# EAGLE design Messchieber (EAGLE 6.4)

## Sheet 1 of 4
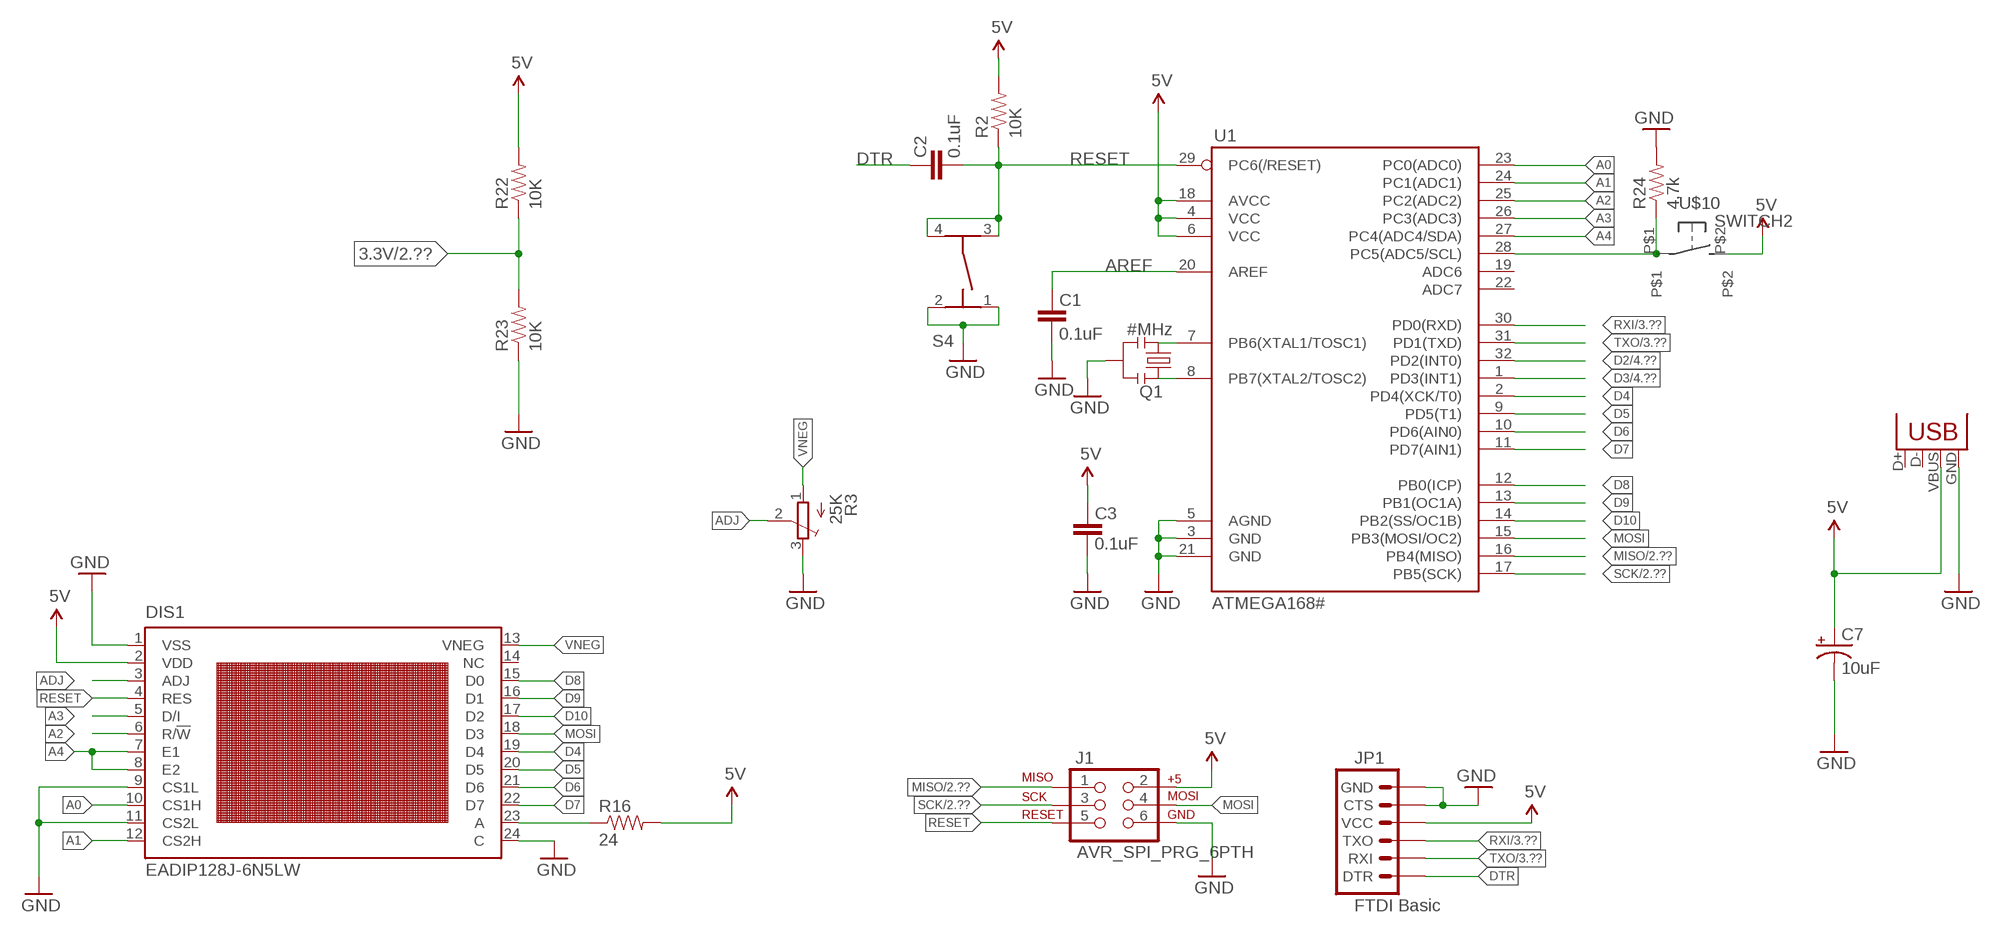
[diagram p0: schematic, sheet 1]

### Parts
C1  0.1uF  CAP0805  [0805]
C2  0.1uF  CAP0805  [0805]
C3  0.1uF  CAP0805  [0805]
C7  10uF  10UF-16V-10%(TANT)  [EIA3216]
DIS1  EADIP128J-6N5LW  [LCD-DIP128-64]
J1  AVR_SPI_PRG_6PTH  [2X3]
JP1  FTDI Basic  ARDUINO_SERIAL_PROGRAMPTH  [1X06]
JP7  USB-SMD-NS  [USB-MINIB-NOSTOP]
Q1  #MHz  RESONATORSMD  [RESONATOR-SMD]
R2  10K  RESISTOR  [0805]
R3  25K  TRIM_EU-SM-42/43A  [SM-42/43A]
R16  24  RESISTOR  [0805]
R22  10K  RESISTOR  [0805]
R23  10K  RESISTOR  [0805]
R24  4,7k  RESISTOR  [0805]
S4  TASTER-9314_SMD  [TASTER-9314_SMD]
U1  ATMEGA168#  ATMEGA168  [TQFP32-08]
U$10  SWITCH2  [SWITCH2]

### Nets
3.3V: R22.1 R23.2 ; also sheet 2,3,4
5V: C3.2 C7.A(+) DIS1.2(VDD) J1.2 JP1.4(VCC) JP7.VBUS R2.2 R16.2 R22.2 U1.4(VCC) U1.6(VCC) U1.18(AVCC) U$10.P$2 ; also sheet 2,3,4
A0: DIS1.10(CS1H) U1.23(PC0(ADC0))
A1: DIS1.12(CS2H) U1.24(PC1(ADC1))
A2: DIS1.6(R/!W) U1.25(PC2(ADC2))
A3: DIS1.5(D/I) U1.26(PC3(ADC3))
A4: DIS1.7(E1) DIS1.8(E2) U1.27(PC4(ADC4/SDA))
ADJ: DIS1.3(ADJ) R3.2(S)
AREF: C1.2 U1.20(AREF)
D2: U1.32(PD2(INT0)) ; also sheet 4
D3: U1.1(PD3(INT1)) ; also sheet 4
D4: DIS1.19(D4) U1.2(PD4(XCK/T0))
D5: DIS1.20(D5) U1.9(PD5(T1))
D6: DIS1.21(D6) U1.10(PD6(AIN0))
D7: DIS1.22(D7) U1.11(PD7(AIN1))
D8: DIS1.15(D0) U1.12(PB0(ICP))
D9: DIS1.16(D1) U1.13(PB1(OC1A))
D10: DIS1.17(D2) U1.14(PB2(SS/OC1B))
DTR: C2.2 JP1.1(DTR)
GND [vcc]: C1.1 C3.1 C7.C(-) DIS1.1(VSS) DIS1.9(CS1L) DIS1.11(CS2L) DIS1.24(C) J1.6 JP1.5(CTS) JP1.6(GND) JP7.GND Q1.2 R3.3(E) R23.1 R24.2 S4.1 S4.2 U1.3(GND) U1.5(AGND) U1.21(GND) ; also sheet 2,3,4
MISO: J1.1 U1.16(PB4(MISO)) ; also sheet 2
MOSI: DIS1.18(D3) J1.4 U1.15(PB3(MOSI/OC2))
N$1: Q1.1 U1.8(PB7(XTAL2/TOSC2))
N$2: Q1.3 U1.7(PB6(XTAL1/TOSC1))
N$6: R24.1 U1.28(PC5(ADC5/SCL)) U$10.P$1
N$29: DIS1.23(A) R16.1
RESET: C2.1 DIS1.4(RES) J1.5 R2.1 S4.3 S4.4 U1.29(PC6(/RESET))
RXI: JP1.3(TXO) U1.30(PD0(RXD)) ; also sheet 3
SCK: J1.3 U1.17(PB5(SCK)) ; also sheet 2
TXO: JP1.2(RXI) U1.31(PD1(TXD)) ; also sheet 3
VNEG: DIS1.13(VNEG) R3.1(A)
Unconnected: DIS1.14(NC) JP7.D+ JP7.D- U1.19(ADC6) U1.22(ADC7)

## Sheet 2 of 4
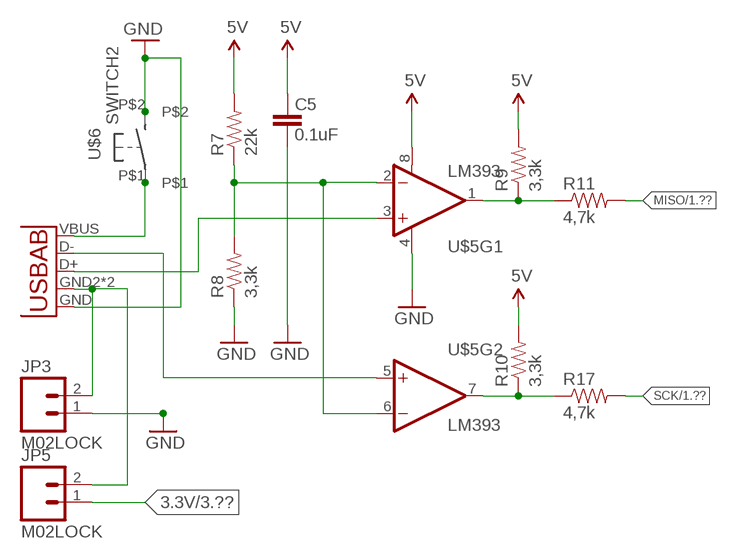
[diagram p1: schematic, sheet 2]

### Parts
C5  0.1uF  CAP0805  [0805]
JP3  M02LOCK  [1X02_LOCK]
JP5  M02LOCK  [1X02_LOCK]
R7  22k  RESISTOR  [0805]
R8  3,3k  RESISTOR  [0805]
R9  3,3k  RESISTOR  [0805]
R10  3,3k  RESISTOR  [0805]
R11  4,7k  RESISTOR  [0805]
R17  4,7k  RESISTOR  [0805]
U$5  LM393  [SO08]
U$6  SWITCH2  [SWITCH2]
U$7  USB-A  [USB-A]

### Nets
3.3V: JP5.1 ; also sheet 1,3,4
5V: C5.2 R7.2 R9.2 R10.2 U$5.8(V+) ; also sheet 1,3,4
DATA1: R9.1 R11.1 U$5.1(OUT)
GND [vcc]: C5.1 JP3.1 R8.1 U$5.4(V-) U$6.P$2 U$7.GND ; also sheet 1,3,4
MISO: R11.2 ; also sheet 1
N$9: R7.1 R8.2 U$5.2(-IN) U$5.6(-IN)
N$10: U$5.3(+IN) U$7.D+
N$11: U$5.5(+IN) U$7.D-
N$14: U$6.P$1 U$7.VBUS
N$15: JP3.2 JP5.2 U$7.GND2(USBID) U$7.GND3(USBID)
SCK: R17.2 ; also sheet 1
SCK1: R10.1 R17.1 U$5.7(OUT)

## Sheet 3 of 4
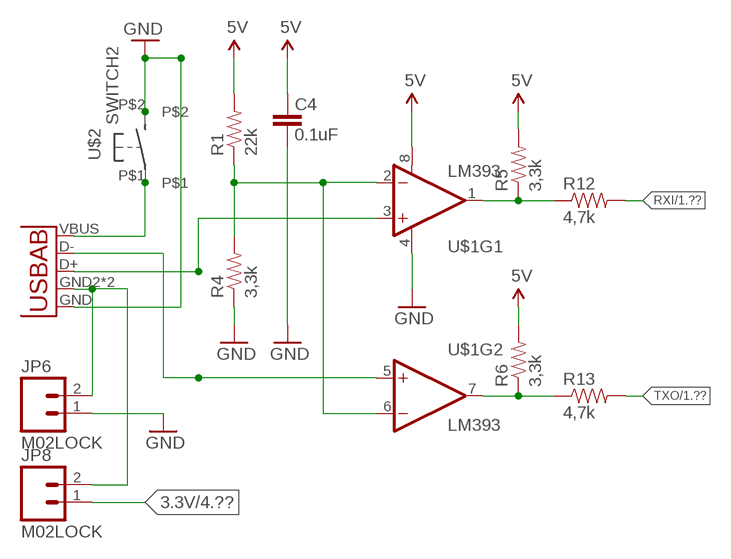
[diagram p2: schematic, sheet 3]

### Parts
C4  0.1uF  CAP0805  [0805]
JP6  M02LOCK  [1X02_LOCK]
JP8  M02LOCK  [1X02_LOCK]
R1  22k  RESISTOR  [0805]
R4  3,3k  RESISTOR  [0805]
R5  3,3k  RESISTOR  [0805]
R6  3,3k  RESISTOR  [0805]
R12  4,7k  RESISTOR  [0805]
R13  4,7k  RESISTOR  [0805]
U$1  LM393  [SO08]
U$2  SWITCH2  [SWITCH2]
U$8  USB-A  [USB-A]

### Nets
3.3V: JP8.1 ; also sheet 1,2,4
5V: C4.2 R1.2 R5.2 R6.2 U$1.8(V+) ; also sheet 1,2,4
DATA2: R5.1 R12.1 U$1.1(OUT)
GND [vcc]: C4.1 JP6.1 R4.1 U$1.4(V-) U$2.P$2 U$8.GND ; also sheet 1,2,4
N$3: R1.1 R4.2 U$1.2(-IN) U$1.6(-IN)
N$4: U$1.3(+IN) U$8.D+
N$5: U$1.5(+IN) U$8.D-
N$19: U$2.P$1 U$8.VBUS
N$20: JP6.2 JP8.2 U$8.GND2(USBID) U$8.GND3(USBID)
RXI: R12.2 ; also sheet 1
SCK2: R6.1 R13.1 U$1.7(OUT)
TXO: R13.2 ; also sheet 1

## Sheet 4 of 4
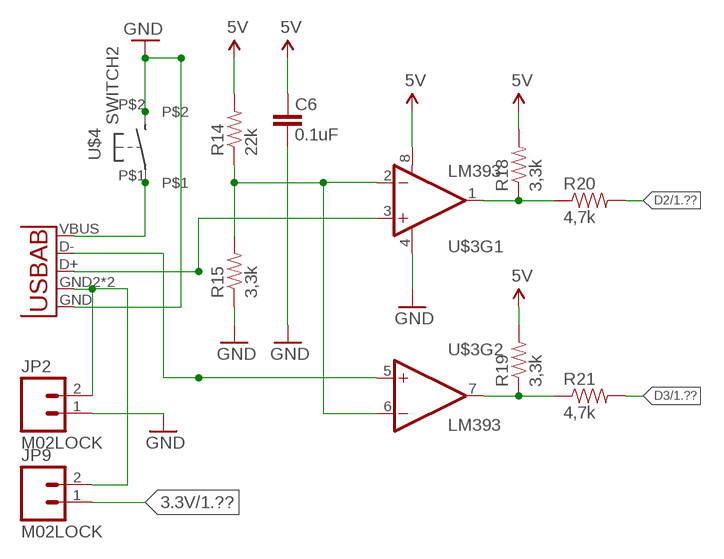
[diagram p3: schematic, sheet 4]

### Parts
C6  0.1uF  CAP0805  [0805]
JP2  M02LOCK  [1X02_LOCK]
JP9  M02LOCK  [1X02_LOCK]
R14  22k  RESISTOR  [0805]
R15  3,3k  RESISTOR  [0805]
R18  3,3k  RESISTOR  [0805]
R19  3,3k  RESISTOR  [0805]
R20  4,7k  RESISTOR  [0805]
R21  4,7k  RESISTOR  [0805]
U$3  LM393  [SO08]
U$4  SWITCH2  [SWITCH2]
U$9  USB-A  [USB-A]

### Nets
3.3V: JP9.1 ; also sheet 1,2,3
5V: C6.2 R14.2 R18.2 R19.2 U$3.8(V+) ; also sheet 1,2,3
D2: R20.2 ; also sheet 1
D3: R21.2 ; also sheet 1
DATA3: R18.1 R20.1 U$3.1(OUT)
GND [vcc]: C6.1 JP2.1 R15.1 U$3.4(V-) U$4.P$2 U$9.GND ; also sheet 1,2,3
N$7: R14.1 R15.2 U$3.2(-IN) U$3.6(-IN)
N$8: U$3.3(+IN) U$9.D+
N$12: U$3.5(+IN) U$9.D-
N$18: U$4.P$1 U$9.VBUS
N$21: JP2.2 JP9.2 U$9.GND2(USBID) U$9.GND3(USBID)
SCK3: R19.1 R21.1 U$3.7(OUT)

## Library data of the parts
C1-C6 = SparkFun:CAP: Capacitor Standard 0603 ceramic capacitor, and 0.1" leaded capacitor.
C7 = SparkFun-Capacitors:10UF-16V-10%(TANT): CAP-00811 1206/EIA-3216 Tantalum capacitor; PROD_ID: CAP-00811
DIS1 = display-lcd:EADIP128*-6N5LW: LCD-GRAFIK MODUL 128x64 PIXEL EA DIP128-6N5LW BLAU-WEISS EA DIP128J-6N5LW SCHWARZ-WEISS ELECTRONIC ASSEMBLY GMBH LOCHHAMER SCHLAG 17 D-82166 GRÄFELFING Source: www.lcd-module.de .. dip128-6.pdf; OC_FARNELL: unknown; OC_NEWARK: unknown
J1 = SparkFun-Connectors:AVR_SPI_PRG_6: AVR ISP 6 Pin This is the reduced ISP connector for AVR programming. Common on Arduino. This footprint will take up less PCB space and can be used with a 10-pin to 6-pin adapter such as SKU: BOB-08508
JP1 = SparkFun:ARDUINO_SERIAL_PROGRAM
JP2 JP3 JP5 JP6 JP8 JP9 = SparkFun-Connectors:M02: Standard 2-pin 0.1" header. Use with - straight break away headers ( PRT-00116) - right angle break away headers (PRT-00553) - swiss pins (PRT-00743) - machine pins (PRT-00117) - female headers (PRT-00115) Molex polarized connector foot print use with: PRT-08233 with associated crimp pins and housings. 2.54_SCREWTERM for use with PRT-10571. 3.5mm Screw Terminal footprints for PRT-08084 5mm Screw Terminal footprints for use with PRT-08433
JP7 = SparkFun-Connectors:USB: USB Connectors USB-B-PTH is fully proven SKU : PRT-00139/CONN-08278 USB-miniB is fully proven SKU : PRT-00587 USB-A-PCB is untested. USB-A-H is throughly reviewed, but untested. Spark Fun Electronics SKU : PRT-00437 USB-B-SMT is throughly reviewed, but untested. Needs silkscreen touching up. USB-A-S has not been used/tested USB-MB-H has not been used/tested USB-MICROB has been used. CONN-09505
Q1 = SparkFun:RESONATOR: Resonator Small SMD resonator. This is the itty bitty 10/20MHz resonators with built in caps. CSTCE10M0G55 and CSTCE20M0V53. Footprint has been reviewed closely but hasn't been tested yet.
R1 R2 R4-R24 = SparkFun:RESISTOR: Resistor Basic schematic elements and footprints for 0603, 1206, and PTH 1/10th watt (small) resistors.
R3 = pot:TRIM_EU-: POTENTIOMETER
S4 = 1_USER:TASTER-9314_SMD
U1 = SparkFun:ATMEGA168
U$1 U$3 U$5 = SparkFun-AnalogIC:LM393: Low-voltage comparator
U$2 U$4 U$6 U$10 = andi:SWITCH2
U$7-U$9 = andi:USB-A

## Net classes
0 default: width 0.203 mm, clearance 0.205 mm
1 vcc: width 0.254 mm, clearance 0.205 mm to class 0, clearance 0.205 mm

## Board
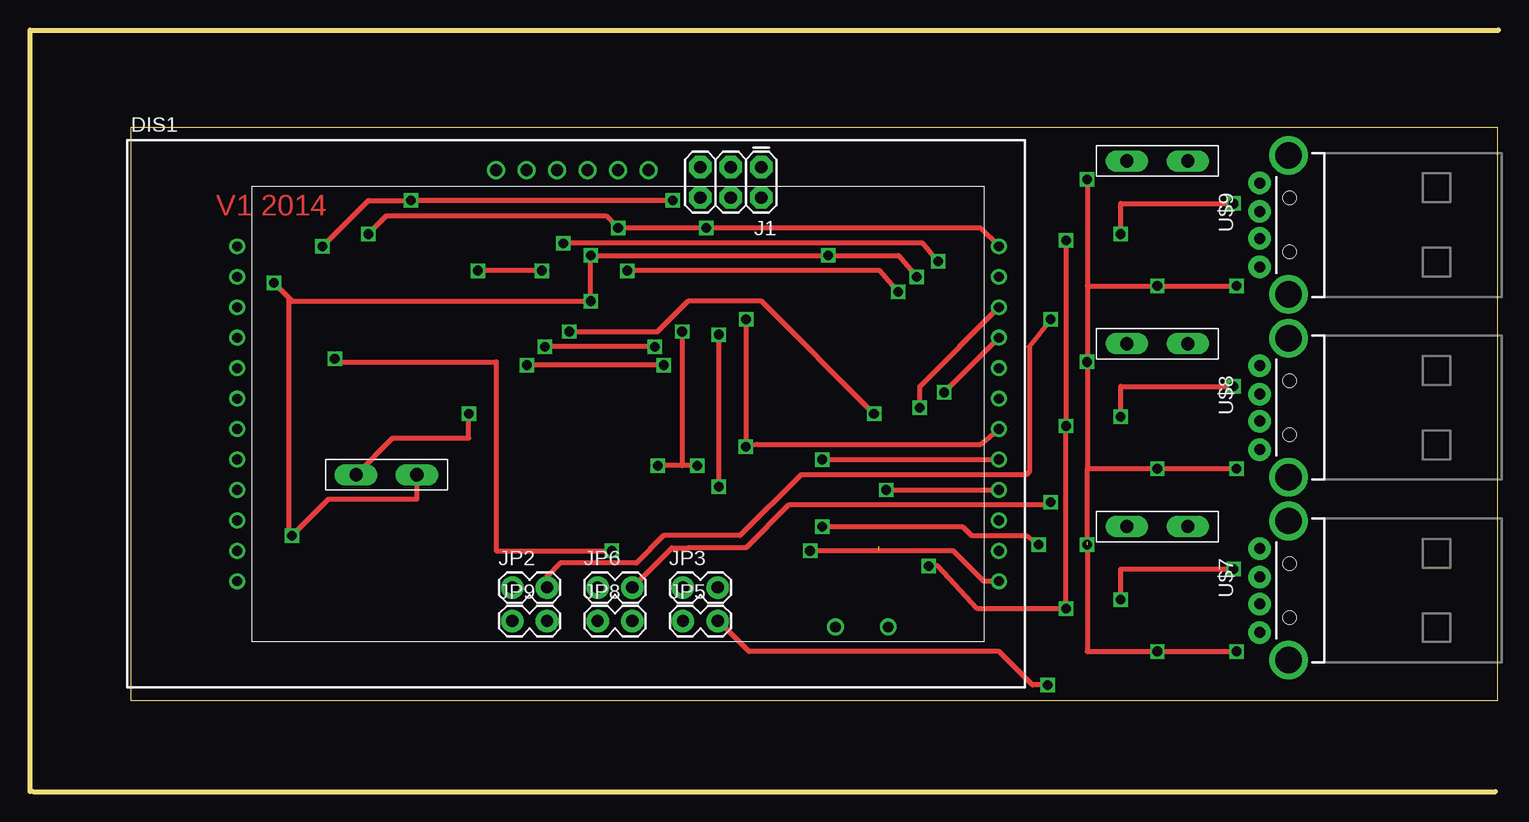
[diagram p4: board, top side]
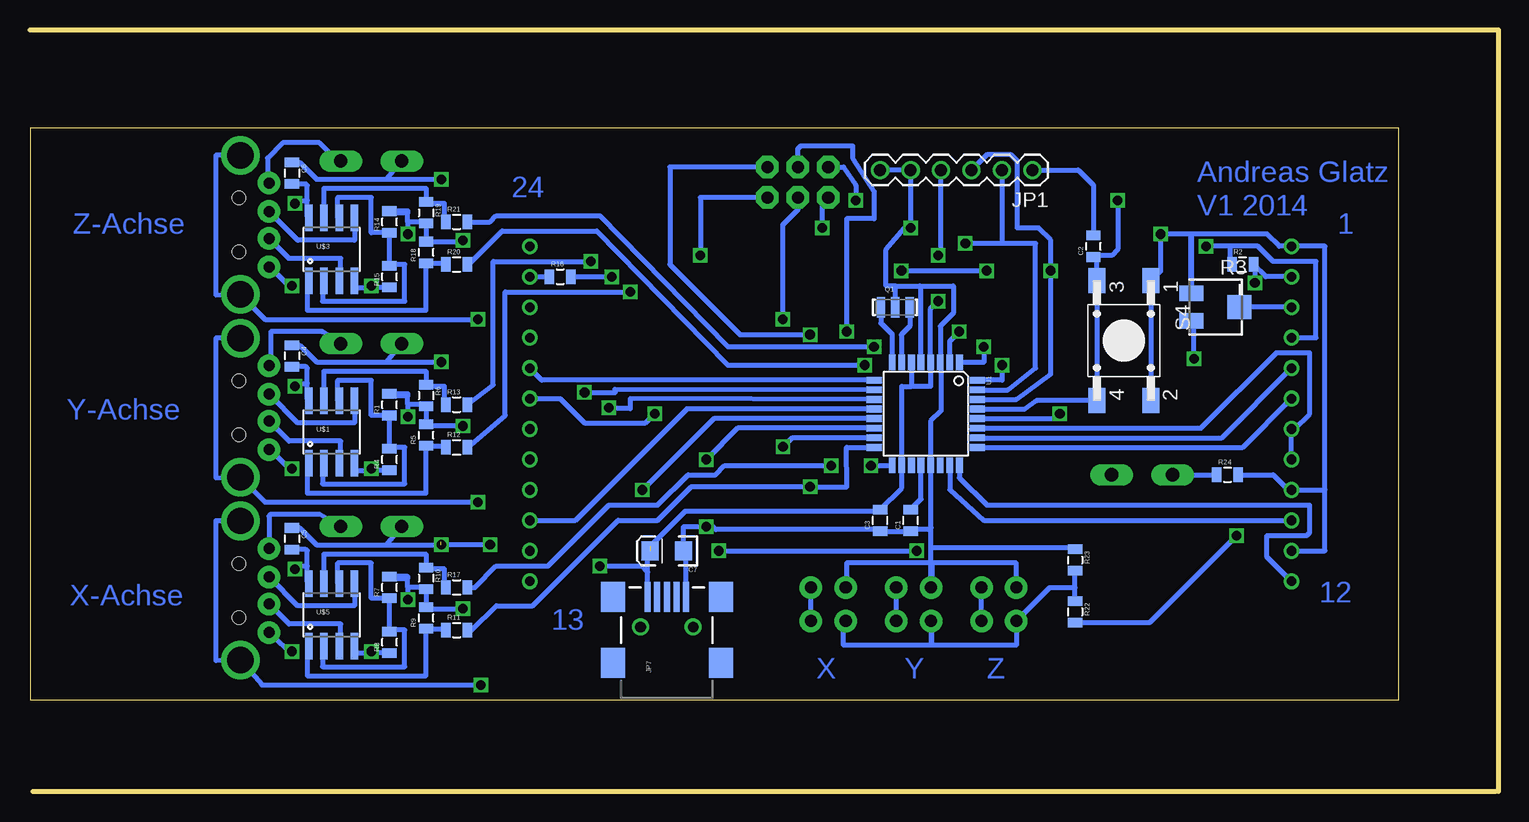
[diagram p5: board, bottom side, seen from below]

Size 122.43 x 63.5 mm. Coordinates in mm from the lower left corner, seen from the top.
Outline: 0.25,0 122.17,0
Outline: 0,0 0,63.5 122.43,63.5
Outline: 8.38,7.62 122.35,7.62 122.35,55.36 8.38,55.36 8.38,7.62
Copper layers (1*16): Top 0.035mm / dielectric 1.5mm / Bottom 0.035mm
Design rules "default": minimum track width 10mil, minimum drill 24mil, track to track 8mil, track to pad 8mil, pad to pad 8mil, via to via 8mil, smd to smd 8mil, copper to edge 40mil, drill to drill 8mil, minimum pad ring 10mil, minimum via ring 8mil, stop-mask expansion 4mil, vias tented up to drill 0mil, thermal gap 10mil

### Footprints (pad centres in the part's own frame; a part is rotated, then mirrored left to right if it is on the bottom)
0805 = smd 0.8 x 1.2: 1 -0.9,0; 2 0.9,0
EIA3216 = smd 1.4 x 1.6: A 1.4,0; C -1.4,0
LCD-DIP128-64 = drill 0.8 pad 1.27: 1 -31.75,13.97; 2 -31.75,11.43; 3 -31.75,8.89; 4 -31.75,6.35; 5 -31.75,3.81; 6 -31.75,1.27; 7 -31.75,-1.27; 8 -31.75,-3.81; 9 -31.75,-6.35; 10 -31.75,-8.89; 11 -31.75,-11.43; 12 -31.75,-13.97; 13 31.75,-13.97; 14 31.75,-11.43; 15 31.75,-8.89; 16 31.75,-6.35; 17 31.75,-3.81; 18 31.75,-1.27; 19 31.75,1.27; 20 31.75,3.81; 21 31.75,6.35; 22 31.75,8.89; 23 31.75,11.43; 24 31.75,13.97
2X3 = drill 1.016 pad 1.88 octagon: 1 0,0; 2 0,2.54; 3 2.54,0; 4 2.54,2.54; 5 5.08,0; 6 5.08,2.54
1X06 = drill 1.016: 1 0,0; 2 2.54,0; 3 5.08,0; 4 7.62,0; 5 10.16,0; 6 12.7,0
1X02_LOCK = drill 1.016 pad 1.88: 1 -0.178,0; 2 2.718,0
USB-MINIB-NOSTOP = smd 2.5 x 0.5: D+ 2.5,0; D- 2.5,0.8; GND 2.5,-1.6; ID 2.5,-0.8; VBUS 2.5,1.6 | smd 2.5 x 2: G1 -3,-4.5; G2 -3,4.5; G3 2.5,4.5; G4 2.5,-4.5 | drill 0.9 pad 0.8: H1 0,2.2 | drill 0.9 pad 0.787: H2 0,-2.2
RESONATOR-SMD = smd 0.7 x 1.7: 1 -1.2,0; 2 0,0; 3 1.2,0
SM-42/43A = smd 2 x 1.3: 1 2,1.15; 3 2,-1.15 | smd 2 x 2: 2 -2,0
TASTER-9314_SMD = smd 2.1 x 1.4: 1 -5,2.25; 2 5,2.25; 3 -5,-2.25; 4 5,-2.25
TQFP32-08 = smd 1.27 x 0.559: 1 -4.293,2.8; 2 -4.293,2; 3 -4.293,1.2; 4 -4.293,0.4; 5 -4.293,-0.4; 6 -4.293,-1.2; 7 -4.293,-2; 8 -4.293,-2.8; 17 4.293,-2.8; 18 4.293,-2; 19 4.293,-1.2; 20 4.293,-0.4; 21 4.293,0.4; 22 4.293,1.2; 23 4.293,2; 24 4.293,2.8 | smd 0.559 x 1.27: 9 -2.8,-4.293; 10 -2,-4.293; 11 -1.2,-4.293; 12 -0.4,-4.293; 13 0.4,-4.293; 14 1.2,-4.293; 15 2,-4.293; 16 2.8,-4.293; 25 2.8,4.293; 26 2,4.293; 27 1.2,4.293; 28 0.4,4.293; 29 -0.4,4.293; 30 -1.2,4.293; 31 -2,4.293; 32 -2.8,4.293
SO08 = smd 0.61 x 2.21: 1 -1.905,-2.616; 2 -0.635,-2.616; 3 0.635,-2.616; 4 1.905,-2.616; 5 1.905,2.616; 6 0.635,2.616; 7 -0.635,2.616; 8 -1.905,2.616
SWITCH2 = drill 1.1 pad 1.778 long: P$1 -2.54,0; P$2 2.54,0
USB-A = drill 0.914 pad 1.88: D+ 10.02,1.127; D- 10.02,-1.127; GND 10.02,3.5; VBUS 10.02,-3.5 | drill 2.2: GND2 7.62,-5.8; GND3 7.62,5.8 | hole 1.1: 7.52,2.25; 7.52,-2.25

### Placement (x,y rotation side)
C1  49.02,22.61 90 bottom
C2  33.78,45.47 90 bottom
C3  51.56,22.61 90 bottom
C4  100.58,36.32 270 bottom
C5  100.58,21.08 270 bottom
C6  100.58,51.56 270 bottom
C7  69.34,20.07 180 bottom
DIS1  49.02,31.5 0 top
J1  60.96,52.07 180 top
JP1  38.86,51.82 180 bottom
JP2  40.39,17.02 0 top
JP3  54.61,17.02 0 top
JP5  54.61,14.22 0 top
JP6  47.5,17.02 0 top
JP7  69.34,13.72 90 bottom
JP8  47.5,14.22 0 top
JP9  40.39,14.22 0 top
Q1  50.29,40.39 0 bottom
R1  92.46,32.26 90 bottom
R2  21.34,43.94 0 bottom
R3  23.62,40.39 180 bottom
R4  92.46,27.69 90 bottom
R5  89.41,29.72 90 bottom
R6  89.41,33.02 270 bottom
R7  92.46,17.02 90 bottom
R8  92.46,12.45 90 bottom
R9  89.41,14.48 90 bottom
R10  89.41,17.78 270 bottom
R11  86.87,13.46 0 bottom
R12  86.87,28.7 0 bottom
R13  86.87,32.26 0 bottom
R14  92.46,47.5 90 bottom
R15  92.46,42.93 90 bottom
R16  78.23,42.93 0 bottom
R17  86.87,17.02 0 bottom
R18  89.41,44.96 90 bottom
R19  89.41,48.26 270 bottom
R20  86.87,43.94 0 bottom
R21  86.87,47.5 0 bottom
R22  35.31,14.99 270 bottom
R23  35.31,19.3 270 bottom
R24  22.61,26.42 0 bottom
S4  31.24,37.59 270 bottom
U1  47.75,31.5 270 bottom
U$1  97.28,29.97 0 bottom
U$2  93.98,37.34 180 top
U$3  97.28,45.21 0 bottom
U$4  93.98,52.58 180 top
U$5  97.28,14.73 0 bottom
U$6  93.98,22.1 180 top
U$7  112.52,16.76 180 top
U$8  112.52,32 180 top
U$9  112.52,47.24 180 top
U$10  29.72,26.42 0 top

### Tracks (layer width: path | path; a pad name or v marks a point on that pad's centre or on a via)
3.3V
  Bottom 0.406: JP5.1 54.61,14.22 54.61,12.19 47.32,12.19 JP8.1 47.24,14.22 47.24,12.19 40.21,12.19 JP9.1 37.41,17.02 35.31,17.02 | R22.1 35.31,17.02 | 35.31,17.02 R23.2
5V  (via drill 0.8)  (1 unrouted)
  Top 0.406: v90.93,16 90.93,18.54 v100.33,18.54 | v90.93,31.24 90.93,33.78 v100.33,33.78 | v90.93,46.48 90.93,49.02 v100.33,49.02 | v86.36,45.97 v86.36,30.48 v86.36,15.24 78.99,15.24 75.69,18.8 v74.93,18.8 | v20.32,42.42 21.59,41.15 | 21.59,41.15 21.84,40.89 v46.74,40.89 v46.74,44.7 v66.55,44.7 72.39,44.7 v73.91,42.93 | 21.59,41.15 21.59,21.59 v21.84,21.34 24.89,24.38 32.26,24.38 U$10.P$2
  Bottom 0.406: R10.2 R9.2 | R10.2 89.41,17.02 90.93,17.02 | 90.93,17.02 90.93,17.78 | 90.93,17.78 90.93,17.92 R7.2 92.46,17.78 90.93,17.78 | U$5.8 99.31,17.48 99.31,18.8 | 99.31,18.8 99.31,20.07 99.43,20.18 C5.2 | 90.93,17.02 v90.93,16 | v100.33,18.54 100.33,18.8 99.31,18.8 | 90.93,32.26 89.41,32.26 R6.2 R5.2 89.27,30.48 v86.36,30.48 | 90.93,32.26 90.93,33.02 | 90.93,33.02 90.93,33.16 R1.2 92.46,33.02 90.93,33.02 | U$1.8 99.31,32.72 99.31,34.04 | 99.31,34.04 99.31,35.31 99.43,35.42 C4.2 | 90.93,32.26 v90.93,31.24 | v100.33,33.78 100.33,34.04 99.31,34.04 | 90.93,47.5 89.41,47.5 R19.2 R18.2 86.48,45.86 v86.36,45.97 | 90.93,47.5 90.93,48.26 | 90.93,48.26 90.93,48.4 R14.2 92.46,48.26 90.93,48.26 | U$3.8 99.31,47.95 99.31,49.28 | 99.31,49.28 99.31,50.55 99.43,50.66 C6.2 | 90.93,47.5 v90.93,46.48 | v100.33,49.02 100.33,49.28 99.31,49.28 | JP7.VBUS 70.94,18.29 | 48.95,33.78 49.75,33.78 U1.18 49.75,25.32 C3.2 51.7,23.37 67.82,23.37 70.74,20.44 | U1.6 48.95,33.78 | 48.95,33.78 47.35,33.78 U1.4 47.35,40.28 v46.74,40.89 | DIS1.2 19.42,42.93 R2.2 20.32,43.83 v20.32,42.42 | R10.2 89.41,15.24 v86.36,15.24 | v74.93,18.8 71.45,18.8 70.94,18.29 | R16.2 v73.91,42.93 | v46.74,44.7 46.48,44.45 JP1.4 | J1.2 66.55,49.53 v66.55,44.7 | 70.94,18.29 70.94,19.87 C7.A | R22.2 29.09,14.09 v21.84,21.34
A0
  Bottom 0.406: U1.23 45.75,25.18 42.93,22.61 DIS1.10
A1
  Bottom 0.406: U1.24 44.95,26.16 42.67,23.88 15.75,23.88 15.75,21.59 16,21.34 19.3,21.34 19.3,19.56 DIS1.12
A2
  Bottom 0.406: U1.25 21.34,28.7 DIS1.6
A3
  Bottom 0.406: U1.26 23.08,29.5 DIS1.5
A4
  Bottom 0.406: 43.94,30.23 43.87,30.3 U1.27 24.82,30.3 18.54,36.58 15.75,36.58 15.75,31.5 17.02,30.23 DIS1.7 DIS1.8
ADJ
  Bottom 0.406: DIS1.3 R3.2
AREF
  Bottom 0.406: C1.2 48.15,24.38 U1.20
D2  (via drill 0.8)
  Top 0.406: v52.83,35.56 v41.4,35.56
  Bottom 0.406: R20.2 85.85,43.94 83.06,46.74 75.18,46.74 64.26,35.56 v52.83,35.56 | v41.4,35.56 41.4,34.3 U1.32
D3  (via drill 0.8)
  Top 0.406: v52.07,37.08 v42.93,37.08
  Bottom 0.406: R21.2 84.07,47.5 83.57,48.01 74.93,48.01 64.26,37.08 v52.07,37.08 | v42.93,37.08 42.93,35.78 U1.1
D4  (via drill 0.8)
  Top 0.406: v70.36,31.5 60.96,40.89 54.86,40.89 52.32,38.35 v44.96,38.35
  Bottom 0.406: DIS1.19 78.23,32.77 76.2,30.73 71.12,30.73 v70.36,31.5 | U1.2 45.75,37.56 v44.96,38.35
D5
  Bottom 0.406: U1.9 79.76,34.3 DIS1.20
D6  (via drill 0.8)
  Top 0.406: v76.2,33.27 DIS1.21
  Bottom 0.406: U1.10 73.66,33.53 73.66,33.24 76.42,33.24 v76.2,33.27
D7  (via drill 0.8)
  Top 0.406: v74.17,32 74.17,33.78 DIS1.22
  Bottom 0.406: U1.11 72.39,32.77 72.39,31.93 73.84,31.93 v74.17,32
D8
  Bottom 0.406: DIS1.15 76.96,22.61 68.71,30.86 68.07,31.5 67.67,31.9 U1.12
D9  (via drill 0.8)
  Top 0.406: v71.37,25.15 DIS1.16
  Bottom 0.406: U1.13 65.42,31.1 v71.37,25.15
D10  (via drill 0.8)
  Top 0.406: v66.04,27.69 DIS1.17
  Bottom 0.406: U1.14 63.43,30.3 v66.04,27.69
DATA1
  Bottom 0.406: U$5.1 99.31,12.12 99.31,9.65 89.41,9.65 R9.1 87.77,13.58 R11.1
DATA2
  Bottom 0.406: U$1.1 99.31,27.36 99.31,24.89 89.41,24.89 R5.1 87.77,28.82 R12.1
DATA3
  Bottom 0.406: U$3.1 99.31,42.6 99.31,40.13 89.41,40.13 R18.1 87.77,44.06 R20.1
DTR
  Bottom 0.406: JP1.1 35.05,51.82 33.78,50.55 C2.2
GND  (via drill 0.8)  (1 unrouted)
  Top 0.406: v100.58,11.68 v93.98,11.68 88.14,11.68 v88.14,20.57 | v100.58,26.92 v93.98,26.92 88.14,26.92 | 88.14,26.92 v88.14,35.81 88.14,42.16 | v100.58,42.16 v93.98,42.16 88.14,42.16 | v88.14,51.05 88.14,42.16 | 88.14,20.83 88.14,26.92 | v66.04,22.1 77.72,22.1 78.49,21.34 83.06,21.34 v84.07,20.57 | v28.19,46.48 29.72,48.01 48.01,48.01 v49.02,46.99 v56.39,46.99 79.25,46.99 DIS1.24
  Bottom 0.406: R8.1 93.98,11.55 | U$5.4 95.38,11.55 93.98,11.55 | C5.1 99.96,21.98 98.55,20.57 92.71,20.57 | 92.71,20.57 U$6.P$2 | U$7.GND 101.09,11.94 100.84,11.68 v100.58,11.68 | 93.98,11.55 v93.98,11.68 | 92.71,20.57 v88.14,20.57 | R4.1 93.98,26.79 | U$1.4 95.38,26.79 93.98,26.79 | C4.1 99.96,37.22 98.55,35.81 92.71,35.81 | 92.71,35.81 U$2.P$2 | 93.98,26.79 v93.98,26.92 | v100.58,26.92 100.84,26.92 102.42,28.5 U$8.GND | 92.71,35.81 v88.14,35.81 | R15.1 93.98,42.03 | U$3.4 95.38,42.03 93.98,42.03 | C6.1 99.96,52.46 98.55,51.05 92.71,51.05 | 92.71,51.05 U$4.P$2 | 93.98,42.03 v93.98,42.16 | v100.58,42.16 100.84,42.16 102.42,43.74 U$9.GND | 92.71,51.05 v88.14,51.05 | JP7.GND 67.74,19.87 C7.C 67.95,22.1 v66.04,22.1 65.53,22.1 65.28,21.84 51.7,21.84 C3.1 C1.1 48.88,21.84 47.5,21.84 47.35,21.99 | 47.35,21.99 U1.21 47.35,30.88 46.48,31.75 46.48,35.72 U1.3 46.55,38.79 45.47,39.88 45.47,42.16 48.26,42.16 | DIS1.11 14.48,20.07 14.48,25.15 | 14.48,25.15 DIS1.9 17.53,25.15 18.8,26.42 R24.2 | 14.48,25.15 14.48,45.47 DIS1.1 18.29,45.47 19.3,46.48 25.62,46.48 R3.3 25.65,41.57 25.65,46.48 v28.19,46.48 28.19,43.39 S4.1 S4.2 | v88.14,20.57 87.88,20.57 | Q1.2 50.29,42.16 | 50.29,42.16 48.26,42.16 | U1.5 48.15,42.02 48.26,42.16 | v84.07,20.57 v88.14,20.57 | JP1.6 JP1.5 v49.02,46.99 v49.03,46.99 49.53,46.99 51.05,45.21 51.05,42.16 50.29,42.16 | JP2.1 40.21,19.05 47.24,19.05 47.24,17.02 JP6.1 47.32,19.05 | 47.32,19.05 54.36,19.05 54.36,17.02 JP3.1 | 47.32,19.05 47.32,20.32 | 47.32,20.32 47.32,21.99 47.35,21.99 | R23.1 35.42,20.32 47.32,20.32 | J1.6 56.39,49.02 v56.39,46.99
MISO  (via drill 0.8)
  Top 0.406: v57.4,38.1 v57.4,25.4
  Bottom 0.406: R11.2 85.6,13.46 83.57,15.49 80.52,15.49 73.41,22.61 70.1,22.61 67.31,25.4 v57.4,25.4 54.32,25.4 54.36,28.7 U1.16 | J1.1 69.09,52.07 69.09,43.94 63.25,38.1 v57.4,38.1
MOSI  (via drill 0.8)
  Top 0.406: DIS1.18 79.25,28.96 60.64,28.96 v59.66,28.73 59.69,29.46 v59.69,39.37
  Bottom 0.406: U1.15 58.93,29.46 v59.66,28.73 | J1.4 58.42,48.51 59.69,47.24 v59.69,39.37
N$1
  Bottom 0.406: Q1.1 51.49,39.05 50.55,38.1 50.55,38.09 U1.8
N$2
  Bottom 0.406: Q1.3 49.09,38.79 49.78,38.1 49.75,38.07 U1.7
N$3
  Bottom 0.406: U$1.6 96.77,32.59 96.77,34.29 93.98,34.29 93.98,31.36 R1.1 R4.2 92.46,28.7 91.19,28.7 91.19,25.65 98.04,25.65 98.04,27.36 U$1.2
N$4
  Bottom 0.406: U$1.3 96.52,27.36 96.52,29.21 100.84,29.21 U$8.D+
N$5
  Bottom 0.406: U$1.5 95.38,30.73 100.11,30.73 U$8.D-
N$6  (via drill 0.8)
  Top 0.406: U$10.P$1 30.23,29.46 36.58,29.46 v36.58,31.5
  Bottom 0.406: U1.28 36.98,31.1 v36.58,31.5 | U$10.P$1 R24.1
N$7
  Bottom 0.406: U$3.6 96.77,47.83 96.77,49.53 93.98,49.53 93.98,46.6 R14.1 R15.2 92.46,43.94 91.19,43.94 91.19,40.89 98.04,40.89 98.04,42.6 U$3.2
N$8
  Bottom 0.406: U$3.3 96.52,42.6 96.52,44.45 100.84,44.45 U$9.D+
N$9
  Bottom 0.406: U$5.6 96.77,17.35 96.77,19.05 93.98,19.05 93.98,16.12 R7.1 R8.2 92.46,13.46 91.19,13.46 91.19,10.41 98.04,10.41 98.04,12.12 U$5.2
N$10
  Bottom 0.406: U$5.3 96.52,12.12 96.52,13.97 100.84,13.97 U$7.D+
N$11
  Bottom 0.406: U$5.5 95.38,15.49 100.11,15.49 U$7.D-
N$12
  Bottom 0.406: U$3.5 95.38,45.97 100.11,45.97 U$9.D-
N$14
  Bottom 0.406: U$6.P$1 98.3,23.11 102.36,23.11 102.5,22.97 U$7.VBUS
N$15  (via drill 0.8)
  Top 0.406: v84.84,8.89 83.57,8.89 80.77,11.68 59.94,11.68 57.4,14.22 JP5.2
  Bottom 0.406: U$7.GND2 106.93,22.56 106.93,10.92 U$7.GND3 103.08,8.89 v84.84,8.89 | JP5.2 JP3.2
N$18
  Bottom 0.406: U$4.P$1 96.77,52.58 98.3,54.1 101.35,54.1 102.62,52.83 102.62,50.86 U$9.VBUS
N$19
  Bottom 0.406: U$2.P$1 98.04,38.35 102.36,38.35 102.36,35.64 U$8.VBUS
N$20  (via drill 0.8)
  Top 0.406: v85.09,24.13 84.84,23.88 63.25,23.88 59.69,20.32 55.12,20.32 54.86,20.32 53.52,20.32 JP6.2
  Bottom 0.406: U$8.GND2 106.93,37.8 106.93,37.34 106.93,26.16 U$8.GND3 102.83,24.13 v85.09,24.13 | JP8.2 JP6.2
N$21  (via drill 0.8)
  Top 0.406: v85.09,39.37 83.31,37.08 83.31,26.67 83.06,26.42 64.26,26.42 59.18,21.34 52.83,21.34 50.55,19.05 44.2,19.05 43.1,17.96 JP2.2
  Bottom 0.406: U$9.GND2 106.93,53.04 106.93,41.4 U$9.GND3 102.83,39.37 v85.09,39.37 | JP9.2 JP2.2
N$29
  Bottom 0.406: DIS1.23 R16.1
RESET  (via drill 0.8)
  Top 0.406: v24.38,45.47 28.19,49.28 v31.75,49.28 v53.59,49.28
  Bottom 0.406: DIS1.4 15.24,37.85 15.24,44.2 18.8,44.2 20.07,45.47 22.35,45.47 | R2.1 22.35,44.06 22.35,45.47 | 22.35,45.47 v24.38,45.47 | J1.5 54.61,52.07 53.59,50.55 v53.59,49.28 | U1.29 39.48,31.9 38.53,32.59 S4.4 S4.3 33.49,44.28 C2.1 33.64,44.7 32.26,44.7 31.75,45.21 v31.75,49.28
RXI  (via drill 0.8)
  Top 0.406: v72.39,41.66 70.87,43.43 v49.78,43.43 | v42.67,43.43 v37.34,43.43
  Bottom 0.406: U1.30 40.2,32.7 37.34,34.8 v37.34,43.43 37.34,45.97 38.35,46.99 40.13,46.99 40.13,52.58 40.64,53.09 42.67,53.09 JP1.3 | R12.2 82.8,31.36 82.8,41.66 v72.39,41.66 | v49.78,43.43 v42.67,43.43
SCK  (via drill 0.8)
  Top 0.406: v55.63,27.18 54.36,27.18 | 54.36,27.18 v52.32,27.18 | v54.36,38.35 54.36,27.18
  Bottom 0.406: R17.2 85.34,17.02 83.57,18.8 79.25,18.8 74.17,23.88 70.1,23.88 67.56,26.42 65.28,26.42 64.52,27.18 v55.63,27.18 | v52.32,27.18 50.58,27.18 U1.17 | J1.3 58.42,53.59 58.17,53.85 53.85,53.85 53.85,52.83 52.07,50.04 52.07,47.75 54.36,47.75 v54.36,38.35
SCK1
  Bottom 0.406: R17.1 87.88,17.02 87.88,18.54 89.41,18.54 R10.1 89.41,19.81 97.92,19.81 U$5.7
SCK2
  Bottom 0.406: R13.1 87.88,32.26 87.88,33.78 89.41,33.78 R6.1 89.41,35.05 97.92,35.05 U$1.7
SCK3
  Bottom 0.406: R21.1 87.88,47.5 87.88,49.02 89.41,49.02 R19.1 89.41,50.29 97.92,50.29 U$3.7
TXO  (via drill 0.8)
  Top 0.406: v75.69,44.2 74.42,45.72 v44.45,45.72
  Bottom 0.406: U1.31 40.93,33.5 38.61,35.31 38.61,45.72 41.4,45.72 | R13.2 83.82,33.9 83.82,44.2 v75.69,44.2 | v44.45,45.72 41.4,45.72 | JP1.2 41.4,45.72
VNEG  (via drill 0.8)
  Top 0.406: DIS1.13 79.5,17.53 76.96,20.07 v65.02,20.07 | v25.4,36.07 25.65,35.81 38.86,35.81 38.86,20.07 v48.51,20.07
  Bottom 0.406: v25.4,36.07 25.4,39.01 R3.1 | v65.02,20.07 v48.51,20.07

### Text on the board
Top: V1 2014
Bottom: Andreas Glatz | 24 | V1 2014 | 1 | Z-Achse | Y-Achse | 12 | X-Achse | 13 | Z | Y | X